# EAGLE design BME280_Breakout (EAGLE 7.2.0)
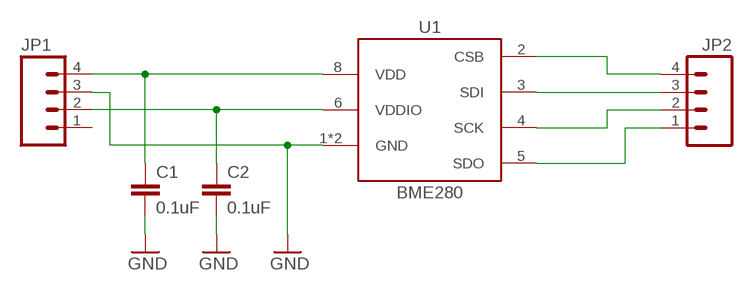
[diagram p0: schematic, sheet 1]

## Parts
C1  0.1uF  0.1UF-16V(+-10%)(0402)  [0402-CAP]
C2  0.1uF  0.1UF-16V(+-10%)(0402)  [0402-CAP]
JP1  M04NO_SILK_ALL_ROUND  [1X04_NO_SILK_ALL_ROUND]
JP2  M04NO_SILK_ALL_ROUND  [1X04_NO_SILK_ALL_ROUND]
U1  BME280  [BME280]

## Nets
GND: C1.2 C2.2 JP1.3 U1.1(GND) U1.7(GND)
N$1: C1.1 JP1.4 U1.8(VDD)
N$2: C2.1 JP1.2 U1.6(VDDIO)
N$4: JP2.3 U1.3(SDI)
N$5: JP2.2 U1.4(SCK)
N$6: JP2.1 U1.5(SDO)
N$7: JP2.4 U1.2(CSB)
Unconnected: JP1.1

## Library data of the parts
C1 C2 = SparkFun-Capacitors:0.1UF-16V(+-10%)(0402); PROD_ID: CAP-12416
JP1 JP2 = SparkFun-Connectors:M04: Header 4 Standard 4-pin 0.1" header. Use with straight break away headers (SKU : PRT-00116), right angle break away headers (PRT-00553), swiss pins (PRT-00743), machine pins (PRT-00117), and female headers (PRT-00115). Molex polarized connector foot print use with SKU : PRT-08231 with associated crimp pins and housings. 1MM SMD Version SKU: PRT-10208
U1 = DensityAltitude:BME280: BOSCH BME280 Combined humidity and pressure sensor Web page: http://www.bosch-sensortec.com/en/homepage/products_3/environmental_sensors_1/bme280/bme280_1 Datasheet: http://ae-bst.resource.bosch.com/media/products/dokumente/bme280/BST-BME280_DS001-09.pdf The BME280 is an integrated environmental sensor developed specifically for mobile applications where size and low power consumption are key design constraints. The unit combines individual high linearity, high accuracy sensors for pressure, humidity and temperature in an 8-pin metal-lid 2.5 x 2.5 x 0.93 mm3 LGA package, designed for low current consumption (3.6 μA @1Hz), long term stability and high EMC robustness. The humidity sensor features an extremely fast response time which supports performance requirements for emerging applications such as context awareness, and high accuracy over a wide temperature range. The pressure sensor is an absolute barometric pressure sensor with features exceptionally high accuracy and resolution at very low noise. The integrated temperature sensor has been optimized for very low noise and high resolution. It is primarily used for temperature compensation of the pressure and humidity sensors, and can also be used for estimating ambient temperature. The BME280 supports a full suite of operating modes which provides the flexibility to optimize the device for power consumption, resolution and filter performance. Key features: - Temperature measurement included - I2C and SPI interfaces - Fully calibrated - Pb-free, halogen-free and RoHS compliant, - MSL 1 Basic specs: Pressure range: 300 to 1100hPa (+9000m to -500m relating to sea level) Supply voltage: 1.71 to 3.6V (VDD), 1.2V to 3.6V (VDDIO) Package: LGA package with metal lid Small footprint: 2.5mm x 2.5mm Super-flat: 0.93mm height Low power: 3.6μA at 1 sample / sec. in standard mode (humidity, pressure and temperature) Low noise: 0.06hPa (0.5m) in ultra low power mode, 0.02hPa (0.17m) advanced resolution mode Typical applications: - Context awareness, e.g. skin detection, room change detection - Health monitoring / well-being • Warning regarding dehydration or heat stroke • Measurement of lung volume and air flow - Home automation control • Control heating, ventilation, air conditioning (HVAC) - Internet of things - GPS enhancement (e.g. time-to-first-fix improvement, dead reckoning, slope detection) - Indoor navigation (change of floor detection, elevator detection) - Outdoor navigation, leisure and sports applications - Weather forecast - Vertical velocity indication (rise/sink speed)

## Board
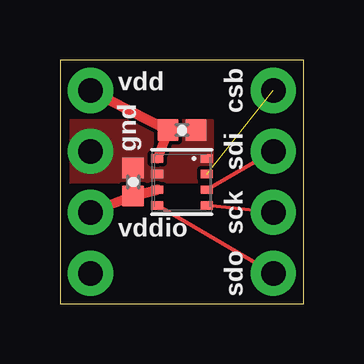
[diagram p1: board, top side]
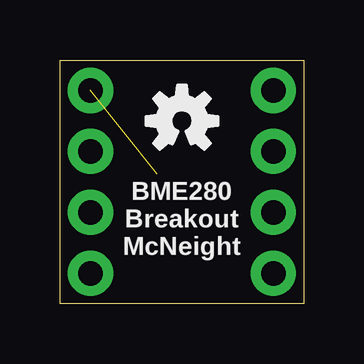
[diagram p2: board, bottom side, seen from below]

Size 10.16 x 10.16 mm. Coordinates in mm from the lower left corner, seen from the top.
Outline: 0,0 10.16,0 10.16,10.16 0,10.16 0,0
Copper layers (1*16): Top 0.0356mm / dielectric 1.5011mm / Bottom 0.0356mm
Design rules "oshpark-2layer": minimum track width 6mil, minimum drill 13mil, track to track 6mil, track to pad 6mil, pad to pad 6mil, via to via 6mil, smd to smd 6mil, copper to edge 15mil, drill to drill 6mil, minimum pad ring 7mil, minimum via ring 7mil, stop-mask expansion 4mil, vias tented up to drill 0mil, thermal gap 10mil

### Footprints (pad centres in the part's own frame; a part is rotated, then mirrored left to right if it is on the bottom)
0402-CAP = smd 0.85 x 0.9: 1 -0.58,0; 2 0.58,0
1X04_NO_SILK_ALL_ROUND = drill 1.016 pad 1.88: 1 0,0; 2 2.54,0; 3 5.08,0; 4 7.62,0
BME280 = smd 0.5 x 0.35: 1 1.025,0.975; 2 1.025,0.325; 3 1.025,-0.325; 4 1.025,-0.975; 5 -1.025,-0.975; 6 -1.025,-0.325; 7 -1.025,0.325; 8 -1.025,0.975

### Placement (x,y rotation side)
C1  5.08,7.24 0 top
C2  3.05,5.08 90 top
JP1  1.27,1.27 90 top
JP2  8.89,1.27 90 top
U1  5.08,5.08 0 top
U$1  [OSHW-LOGO-S]  5.08,7.62 0 bottom

### Tracks (layer width: path | path; a pad name or v marks a point on that pad's centre or on a via)
GND
  pour Top (no thermals): 0,5.08 6.35,5.08 6.35,7.62 0,7.62
N$1
  Top 0.406: JP1.4 C1.1 U1.8
N$2
  Top 0.406: JP1.2 C2.1 U1.6
N$4
  Top 0.152: U1.3 JP2.3
N$5
  Top 0.152: U1.4 JP2.2
N$6
  Top 0.152: U1.5 JP2.1
N$7  (1 unrouted)

### Text on the board
tPlace: vdd | csb | gnd | sdi | sck | vddio | sdo
bPlace: BME280 / Breakout / McNeight